# Altium schematic sheet Power_Regulation.SchDoc
size B
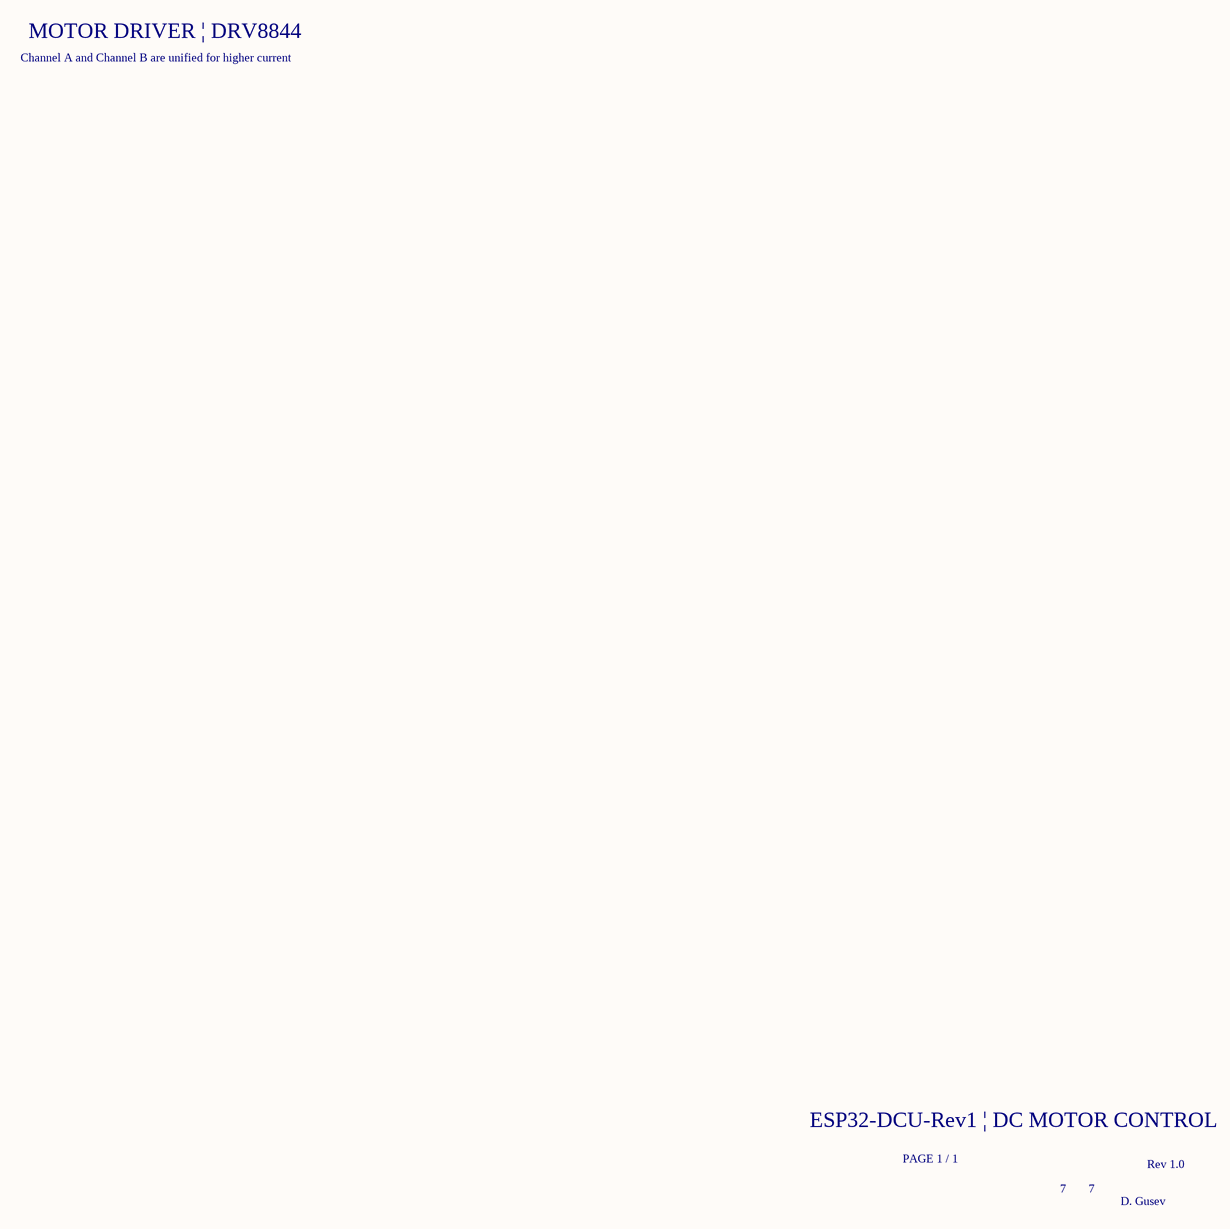
[diagram p0: Power_Regulation.SchDoc]

## Notes on the sheet
- MOTOR DRIVER | DRV8844
- Channel A and Channel B are unified for higher current
- ESP32-DCU-Rev1 | DC MOTOR CONTROL
- PAGE 1 / 1
- 7
- Rev 1.0
- D. Gusev